# EAGLE design main (EAGLE 7.4.0)
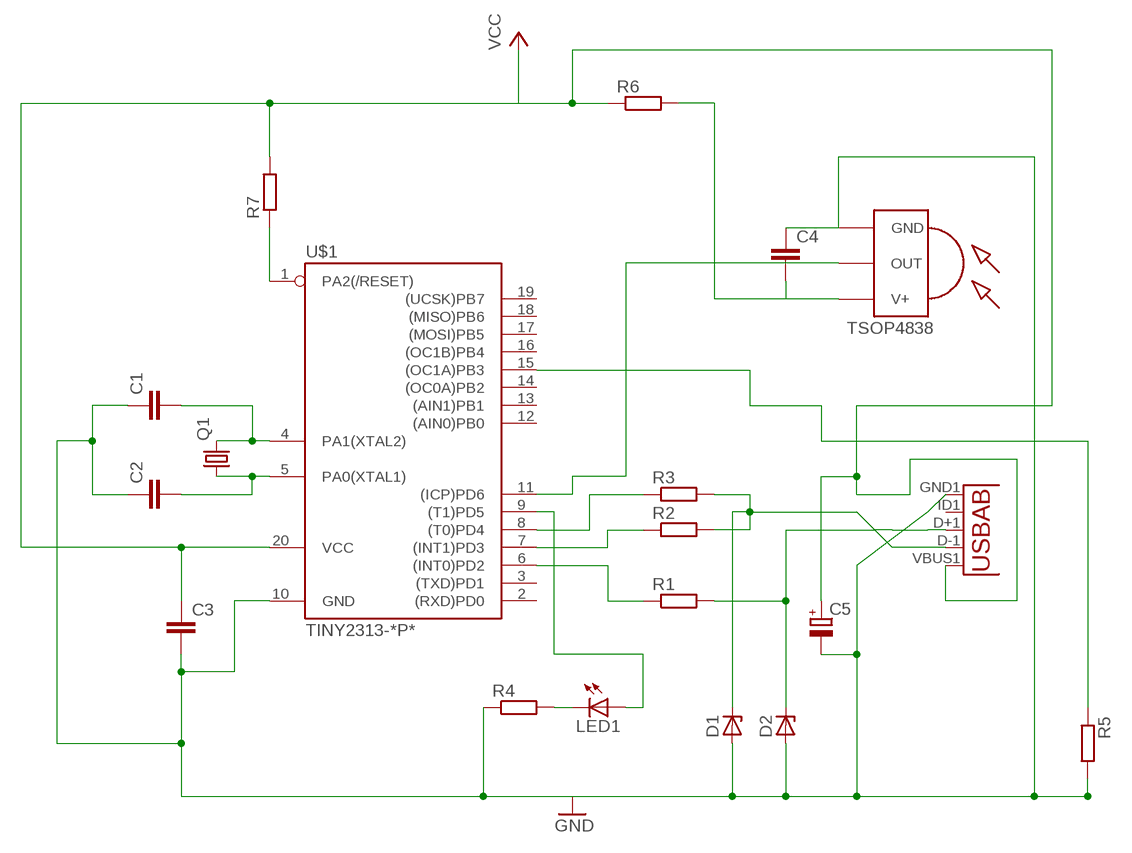
[diagram p0: schematic, sheet 1]

## Parts
C1  C-EUC0603  [C0603]
C2  C-EUC0603  [C0603]
C3  C-EUC0603  [C0603]
C4  C-EUC0603  [C0603]
C5  CPOL-EUE2.5-6  [E2,5-6]
D1  ZENER-DIODESOD80C  [SOD80C]
D2  ZENER-DIODESOD80C  [SOD80C]
LED1  LED3MM  [LED3MM]
Q1  CRYSTALHC49U70  [HC49U70]
R1  R-EU_R0805  [R0805]
R2  R-EU_R0603  [R0603]
R3  R-EU_R0805  [R0805]
R4  R-EU_R0603  [R0603]
R5  R-EU_R0603  [R0603]
R6  R-EU_R0603  [R0603]
R7  R-EU_R0603  [R0603]
U1  USB""  [USB-MICRO-SMD]
U$1  TINY2313-*P*  [DIL20]
U$2  TSOP4838  [TSOP18XX]

## Nets
GND: C1.1 C2.1 C3.2 C4.1 C5.- D1.A D2.A R4.1 R5.2 U1.GND1(GND) U$1.10(GND) U$2.GND
N$1: C1.2 Q1.2 U$1.4(PA1(XTAL2))
N$2: C2.2 Q1.1 U$1.5(PA0(XTAL1))
N$4: R7.1 U$1.1(PA2(/RESET))
N$5: C3.1 C5.+ R6.1 R7.2 U1.VBUS1(VBUS) U$1.20(VCC)
N$6: LED1.K(C) R4.2
N$7: R5.1 U$1.15((OC1A)PB3)
N$8: LED1.A U$1.9((T1)PD5)
N$9: R3.1 U$1.8((T0)PD4)
N$10: R2.1 U$1.7((INT1)PD3)
N$11: R1.1 U$1.6((INT0)PD2)
N$15: U$1.11((ICP)PD6) U$2.OUT
N$16: D1.C R2.2 R3.2 U1.D-1(D-)
N$18: D2.C R1.2 U1.D+1(D+)
N$19: C4.2 R6.2 U$2.VCC(V+)
Unconnected: U1.ID1(USBID) U$1.2((RXD)PD0) U$1.3((TXD)PD1) U$1.12((AIN0)PB0) U$1.13((AIN1)PB1) U$1.14((OC0A)PB2) U$1.16((OC1B)PB4) U$1.17((MOSI)PB5) U$1.18((MISO)PB6) U$1.19((UCSK)PB7)

## Library data of the parts
C1-C4 = resistor:C-EU: CAPACITOR, European symbol
C5 = rcl:CPOL-EU: POLARIZED CAPACITOR, European symbol
D1 D2 = diode:ZENER-DIODE: Z-Diode
LED1 = led:LED: LED OSRAM: - CHIPLED LG R971, LG N971, LY N971, LG Q971, LY Q971, LO R971, LY R971 LH N974, LH R974 LS Q976, LO Q976, LY Q976 LO Q996 - Hyper CHIPLED LW Q18S LB Q993, LB Q99A, LB R99A - SideLED LS A670, LO A670, LY A670, LG A670, LP A670 LB A673, LV A673, LT A673, LW A673 LH A674 LY A675 LS A676, LA A676, LO A676, LY A676, LW A676 LS A679, LY A679, LG A679 - Hyper Micro SIDELED® LS Y876, LA Y876, LO Y876, LY Y876 LT Y87S - SmartLED LW L88C, LW L88S LB L89C, LB L89S, LG L890 LS L89K, LO L89K, LY L89K LS L896, LA L896, LO L896, LY L896 - TOPLED LS T670, LO T670, LY T670, LG T670, LP T670 LSG T670, LSP T670, LSY T670, LOP T670, LYG T670 LG T671, LOG T671, LSG T671 LB T673, LV T673, LT T673, LW T673 LH T674 LS T676, LA T676, LO T676, LY T676, LB T676, LH T676, LSB T676, LW T676 LB T67C, LV T67C, LT T67C, LS T67K, LO T67K, LY T67K, LW E67C LS E67B, LA E67B, LO E67B, LY E67B, LB E67C, LV E67C, LT E67C LW T67C LS T679, LY T679, LG T679 LS T770, LO T770, LY T770, LG T770, LP T770 LB T773, LV T773, LT T773, LW T773 LH T774 LS E675, LA E675, LY E675, LS T675 LS T776, LA T776, LO T776, LY T776, LB T776 LHGB T686 LT T68C, LB T68C - Hyper Mini TOPLED® LB M676 - Mini TOPLED Santana® LG M470 LS M47K, LO M47K, LY M47K Source: http://www.osram.convergy.de LUXEON: - LUMILED® LXK2-PW12-R00, LXK2-PW12-S00, LXK2-PW14-U00, LXK2-PW14-V00 LXK2-PM12-R00, LXK2-PM12-S00, LXK2-PM14-U00 LXK2-PE12-Q00, LXK2-PE12-R00, LXK2-PE12-S00, LXK2-PE14-T00, LXK2-PE14-U00 LXK2-PB12-K00, LXK2-PB12-L00, LXK2-PB12-M00, LXK2-PB14-N00, LXK2-PB14-P00, LXK2-PB14-Q00 LXK2-PR12-L00, LXK2-PR12-M00, LXK2-PR14-Q00, LXK2-PR14-R00 LXK2-PD12-Q00, LXK2-PD12-R00, LXK2-PD12-S00 LXK2-PH12-R00, LXK2-PH12-S00 LXK2-PL12-P00, LXK2-PL12-Q00, LXK2-PL12-R00 Source: www.luxeon.com KINGBRIGHT: KA-3528ASYC Source: www.kingbright.com
Q1 = crystal:CRYSTAL: CRYSTAL; OC_FARNELL: unknown; OC_NEWARK: unknown
R1-R7 = resistor:R-EU_: RESISTOR, European symbol
U1 = MicroUSB:USB: This is a USB AB connector that is compatible with USB OTG. i.e. this connector can serve as a host or device
U$1 = avr-6:TINY2313*: Atmel Tiny2313 2K Flash, 128 bytes EEPROM, 128 bytes RAM
U$2 = tsop-1:TSOP4838: IR Receiver and Demodulator

## Board
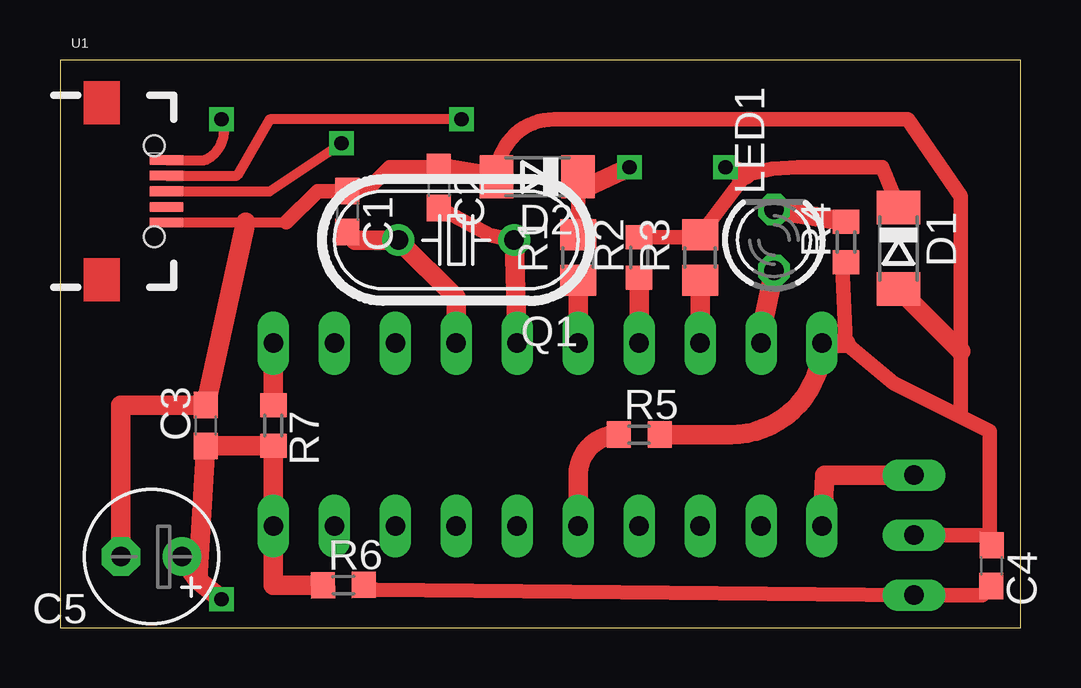
[diagram p1: board, top side]
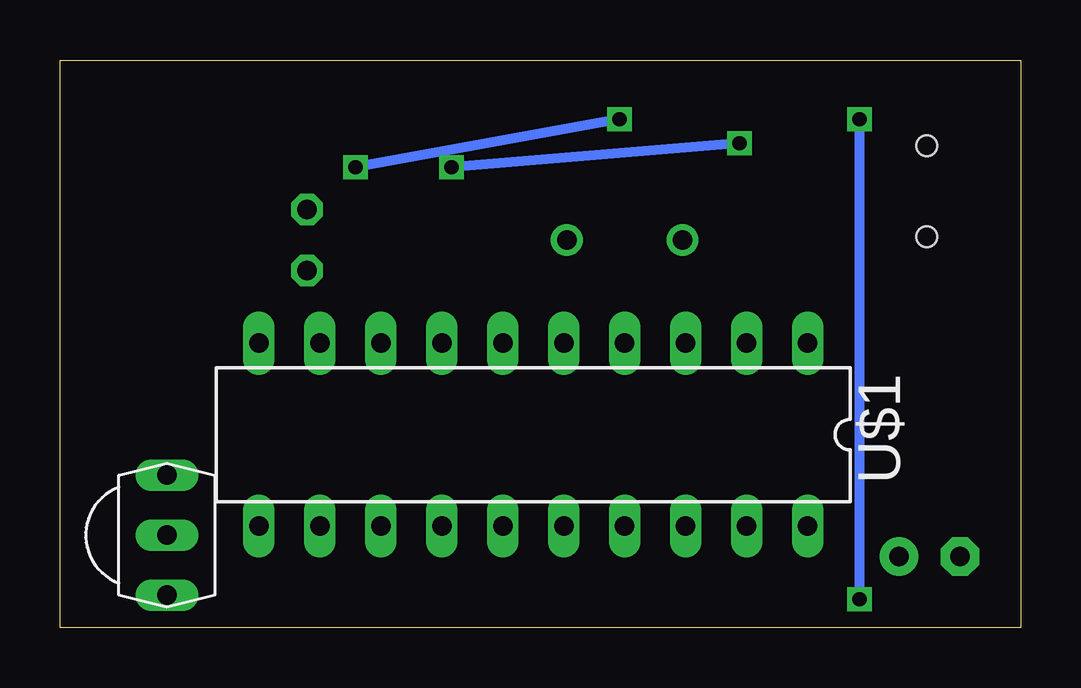
[diagram p2: board, bottom side, seen from below]

Size 40.04 x 23.66 mm. Coordinates in mm from the lower left corner, seen from the top.
Outline: 0,0 40.04,0 40.04,23.66 0,23.66 0,0
Copper layers (1*16): Top 0.035mm / dielectric 1.5mm / Bottom 0.035mm
Design rules "default": minimum track width 10mil, minimum drill 24mil, track to track 8mil, track to pad 8mil, pad to pad 8mil, via to via 8mil, smd to smd 8mil, copper to edge 40mil, drill to drill 8mil, minimum pad ring 10mil, minimum via ring 8mil, stop-mask expansion 4mil, vias tented up to drill 0mil, thermal gap 10mil

### Footprints (pad centres in the part's own frame; a part is rotated, then mirrored left to right if it is on the bottom)
C0603 = smd 1.1 x 1: 1 -0.85,0; 2 0.85,0
E2,5-6 = drill 0.813 pad 1.6: + -1.27,0 | drill 0.813 pad 1.6 octagon: - 1.27,0
SOD80C = smd 1.4 x 1.8: A 1.7,0; C -1.7,0
LED3MM = drill 0.813 octagon: A -1.27,0; K 1.27,0
HC49U70 = drill 0.813: 1 -2.413,0; 2 2.413,0
R0805 = smd 1.3 x 1.5: 1 -0.95,0; 2 0.95,0
R0603 = smd 1 x 1.1: 1 -0.85,0; 2 0.85,0
USB-MICRO-SMD = smd 1.4 x 0.4: D+1 2.7,0; D-1 2.7,0.65; GND1 2.7,-1.3; ID1 2.7,-0.65; VBUS1 2.7,1.3 | hole 0.85: 2.2,1.9; 2.2,-1.9
DIL20 = drill 0.813 long: 1 -11.43,-3.81; 2 -8.89,-3.81; 3 -6.35,-3.81; 4 -3.81,-3.81; 5 -1.27,-3.81; 6 1.27,-3.81; 7 3.81,-3.81; 8 6.35,-3.81; 9 8.89,-3.81; 10 11.43,-3.81; 11 11.43,3.81; 12 8.89,3.81; 13 6.35,3.81; 14 3.81,3.81; 15 1.27,3.81; 16 -1.27,3.81; 17 -3.81,3.81; 18 -6.35,3.81; 19 -8.89,3.81; 20 -11.43,3.81
TSOP18XX = drill 0.813 long: GND -0.001,-0.027; OUT -2.501,-0.027; VCC 2.499,-0.027

### Placement (x,y rotation side)
C1  11.97,17.35 270 top
C2  15.78,18.35 270 top
C3  6.08,8.43 90 top
C4  38.81,2.59 269.5 top
C5  3.81,2.97 180 top
D1  34.94,15.81 270 top
D2  19.89,18.79 180 top
LED1  29.75,16.16 90 top
Q1  16.51,16.16 180 top
R1  21.59,15.43 90 top
R2  24.13,15.43 90 top
R3  26.67,15.43 90 top
R4  32.75,16.08 90 top
R5  24.13,8.05 0 top
R6  11.81,1.78 0.6 top
R7  8.89,8.43 270 top
U1  1.73,18.19 0 top
U$1  20.32,8.05 180 bottom
U$2  35.56,3.86 270 bottom

### Tracks (layer width: path | path; a pad name or v marks a point on that pad's centre or on a via)
GND
  Top 0.406: 13.73,19.19 13.79,19.19 | U1.GND1 7.73,16.89 9.43,16.89 | C1.1
  Top 0.61: U$2.GND 38.73,3.86 | 38.73,3.86 38.73,8.19 37.53,8.79 | 37.53,8.79 34.73,10.19 32.73,11.86 32.59,15.1 R4.1 | 37.53,8.79 37.53,11.52 37.53,17.99 35.33,21.19 20.59,21.19 arc90 D2.A | 13.79,19.19 C2.1 | C1.1 12.97,18.43 13.73,19.19 | 9.43,16.89 10.73,18.19 C1.1 | C4.1 38.73,3.86
  Top 0.813: R5.2 27.94,8.05 arc90 U$1.10 32.73,11.86 | D1.A 37.53,11.52 | D2.A C2.1 | C5.- 2.54,9.28 C3.2 7.73,16.89
N$1
  Top 0.61: 12.31,16.16 C1.2
  Top 0.813: 12.31,16.16 Q1.2 16.51,13.75 U$1.4
N$2
  Top 0.61: C2.2 17.92,16.36 Q1.1
  Top 0.813: Q1.1 U$1.5
N$4
  Top 0.813: U$1.1 R7.1
N$5  (via drill 0.6)
  Top 0.406: U1.VBUS1 6.03,19.49 arc90 v6.73,21.19
  Top 0.813: R6.1 8.89,1.77 U$1.20 R7.2 C3.1 5.73,1.97 | 5.73,1.97 C5.+ | v6.73,1.19 5.73,1.97
  Bottom 0.406: v6.73,21.19 v6.73,1.19
N$6
  Top 0.813: LED1.K R4.2
N$7
  Top 0.813: R5.1 arc90 21.59,6.36 U$1.15
N$8
  Top 0.61: 29.21,12.35 U$1.9
  Top 0.813: LED1.A 29.21,12.35
N$9
  Top 0.813: R3.1 U$1.8
N$10
  Top 0.813: R2.1 U$1.7
N$11
  Top 0.813: R1.1 U$1.6
N$15
  Top 0.813: U$1.11 31.87,6.36 U$2.OUT
N$16  (via drill 0.6)
  Top 0.406: U1.D-1 7.38,18.84 8.73,21.19 v16.73,21.19
  Top 0.61: D1.C 34.26,19.19 30.73,19.19 29.67,19.13 28.58,18.88 R3.2 26.57,16.28 R2.2
  Top 0.813: v27.73,19.19 28.58,18.88
  Bottom 0.406: v16.73,21.19 v27.73,19.19
N$18  (via drill 0.6)
  Top 0.406: U1.D+1 8.73,18.19 v11.73,20.19
  Top 0.61: D2.C 21.59,18.19 R1.2
  Top 0.813: v23.73,19.19 21.59,18.19
  Bottom 0.406: v11.73,20.19 v23.73,19.19
N$19
  Top 0.61: R6.2 13.15,1.6 U$2.VCC 38.42,1.36 C4.2